# EAGLE design ControlPanel (EAGLE 9.6.2)
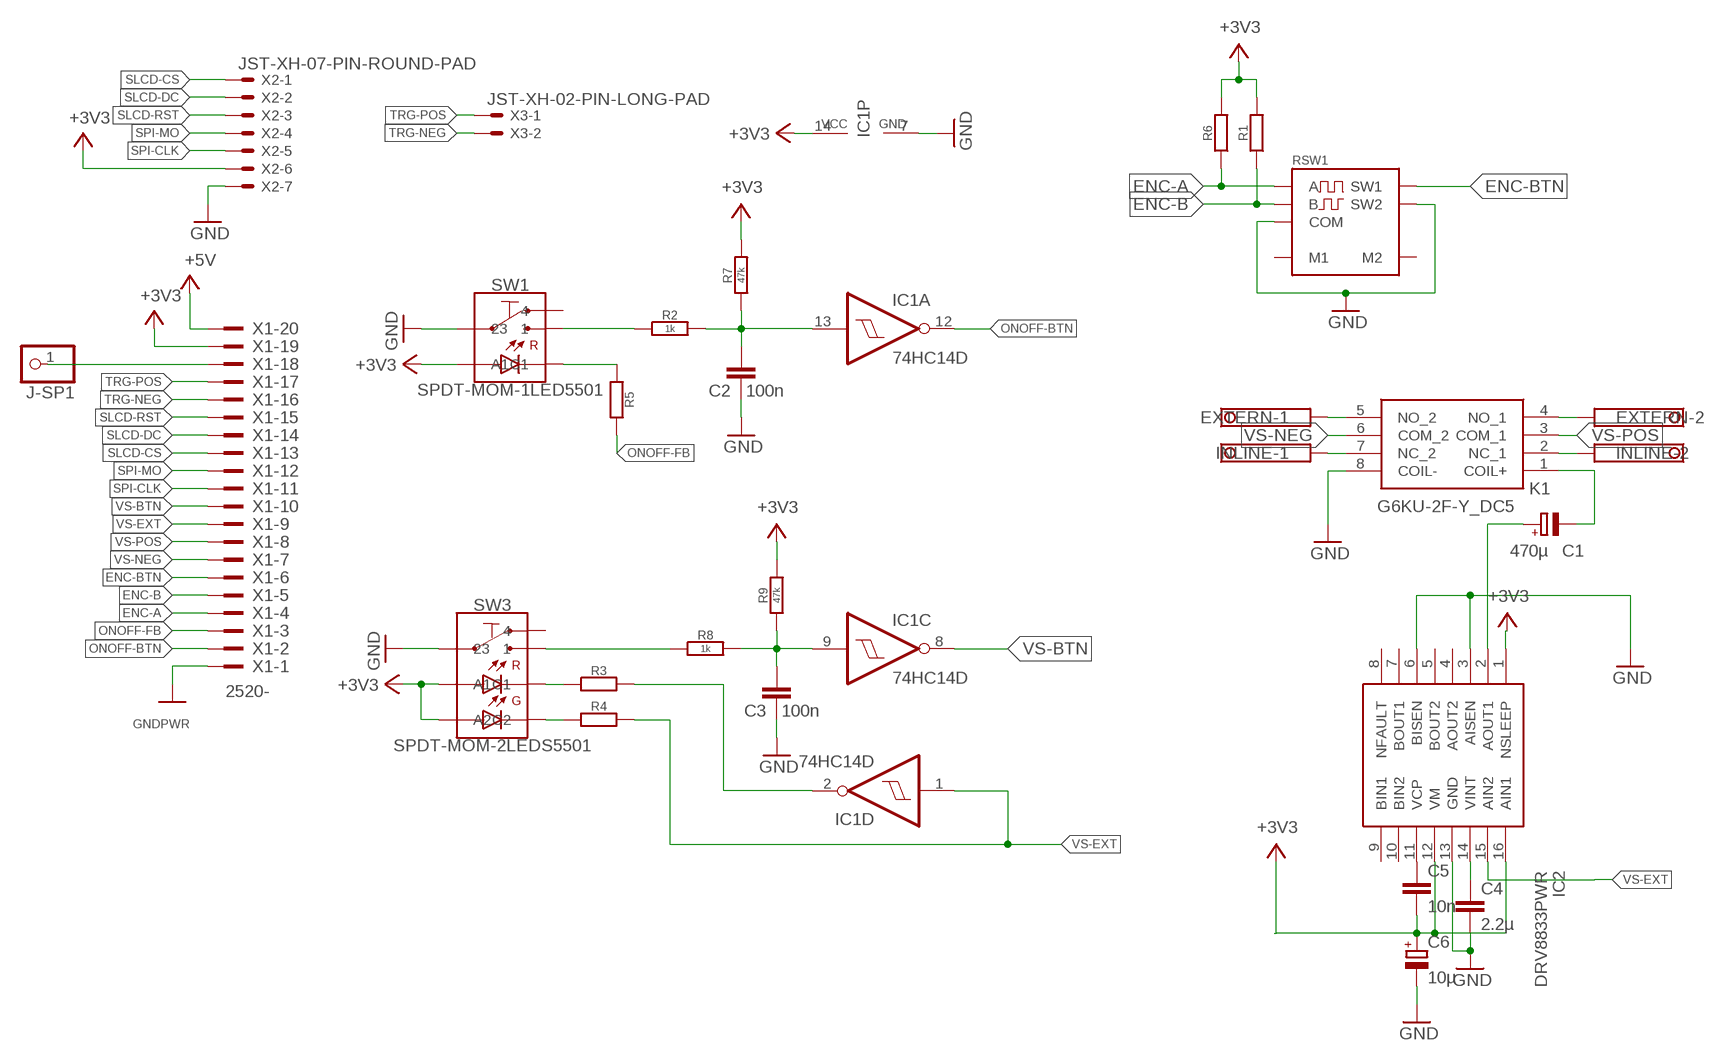
[diagram p0: schematic, sheet 1]

## Parts
C1  470µ  CPOL-EUE5-10.5  [E5-10,5]
C2  100n  CAPACITOR805  [0805]
C3  100n  CAPACITOR805  [0805]
C4  2.2µ  CAPACITOR805  [0805]
C5  10n  CAPACITOR805  [0805]
C6  10µ  CPOL-EUE2-5  [E2-5]
EXTERN  1751248  [1751248]
IC1  74HC14D  [SO14]
IC2  DRV8833PWR  [SOP65P640X120-16N]
INLINE  1751248  [1751248]
J-SP1  PINHD-1X1  [1X01]
K1  G6KU-2F-Y_DC5  [G6KU2FYDC5]
R1  RESISTOR1206  [1206]
R2  1k  RESISTOR805  [0805]
R3  RESISTOR1206  [1206]
R4  RESISTOR1206  [1206]
R5  RESISTOR1206  [1206]
R6  RESISTOR1206  [1206]
R7  47k  RESISTOR805  [0805]
R8  1k  RESISTOR805  [0805]
R9  47k  RESISTOR805  [0805]
RSW1  SW-EC11E  [EC11E]
SW1  SPDT-MOM-1LED5501  [5501-BTN-1LED]
SW3  SPDT-MOM-2LEDS5501  [5501-BTN-2LEDS]
X1  2520-  [PAK100/2500-20]
X2  JST-XH-07-PIN-ROUND-PAD  [JST-XH-07-PACKAGE-ROUND-PAD]
X3  JST-XH-02-PIN-LONG-PAD  [JST-XH-02-PACKAGE-LONG-PAD]

## Nets
+3V3: C5.2 C6.+ IC1.14(P:VCC) IC2.1(NSLEEP) IC2.12(VM) IC2.16(AIN1) R1.2 R6.2 R7.2 R9.2 SW1.5(A1) SW3.5(A1) SW3.8(A2) X1.19 X2.6
+5V: X1.20
ENC-A: R6.1 RSW1.A X1.4
ENC-B: R1.1 RSW1.B X1.5
ENC-BTN: RSW1.SW1 X1.6
GND: C2.1 C3.1 C4.2 C6.- IC1.7(P:GND) IC2.3(AISEN) IC2.6(BISEN) IC2.13(GND) K1.8(COIL-) RSW1.C(COM) RSW1.SW2 SW1.2 SW1.3 SW3.2 SW3.3 X1.1 X2.7 ; supply symbol labelled GNDPWR
N$1: R8.1 SW3.1
N$2: EXTERN.1 K1.5(NO_2)
N$3: R5.1 SW1.8(C1)
N$4: R2.1 SW1.1
N$6: R4.1 SW3.7(C2)
N$7: R3.1 SW3.6(C1)
N$8: INLINE.1 K1.7(NC_2)
N$9: C2.2 IC1.13(A:I) R2.2 R7.1
N$10: INLINE.2 K1.2(NC_1)
N$12: EXTERN.2 K1.4(NO_1)
N$13: C1.- K1.1(COIL+)
N$14: C1.+ IC2.2(AOUT1)
N$15: C4.1 IC2.14(VINT)
N$16: C3.2 IC1.9(C:I) R8.2 R9.1
N$17: C5.1 IC2.11(VCP)
N$23: J-SP1.1 X1.18
ONOFF-BTN: IC1.12(A:O) X1.2
ONOFF-FB: R5.2 X1.3
SLCD-CS: X1.13 X2.1
SLCD-DC: X1.14 X2.2
SLCD-RST: X1.15 X2.3
SPI-CLK: X1.11 X2.5
SPI-MO: X1.12 X2.4
TRG-NEG: X1.16 X3.2
TRG-POS: X1.17 X3.1
V-INL: IC1.2(D:O) R3.2
VS-BTN: IC1.8(C:O) X1.10
VS-EXT: IC1.1(D:I) IC2.15(AIN2) R4.2 X1.9
VS-NEG: K1.6(COM_2) X1.7
VS-POS: K1.3(COM_1) X1.8
Unconnected: IC1.3(E:I) IC1.4(E:O) IC1.5(F:I) IC1.6(F:O) IC1.10(B:O) IC1.11(B:I) IC2.4(AOUT2) IC2.5(BOUT2) IC2.7(BOUT1) IC2.8(NFAULT) IC2.9(BIN1) IC2.10(BIN2) RSW1.M11(M1) RSW1.M12(M1) RSW1.M21(M2) RSW1.M22(M2) SW1.4 SW3.4

## Library data of the parts
C1 C6 = resistor:CPOL-EU: POLARIZED CAPACITOR, European symbol
C2-C5 = VDS-Basics:CAPACITOR
EXTERN INLINE = con-phoenix-350:1751248: MKDS 1/ 2-3,5 Printklemme Nennstrom: 10 A Bemessungsspannung: 160 V Raster: 3,5 mm Polzahl: 2 Montageart: Löten Anschlussart: Schraubanschluss Anschlussrichtung vom Leiter zur Platine: 0° Source: http://eshop.phoenixcontact.com .. 1751248.pdf; OC_FARNELL: unknown; OC_NEWARK: unknown
IC1 = 74xx-eu:74*14: Hex schmitt trigger INVERTER
IC2 = SamacSys_Parts:DRV8833PWR: 2A Low Voltage Dual Brushed DC or Single Bipolar Stepper Motor Driver (PWM Ctrl) Source: Datasheet <http://www.ti.com/lit/gpn/drv8833>; ARROW_PART_NUMBER: DRV8833PWR; ARROW_PRICE-STOCK: https://www.arrow.com/en/products/drv8833pwr/texas-instruments; DESCRIPTION: 2A Low Voltage Dual Brushed DC or Single Bipolar Stepper Motor Driver (PWM Ctrl); HEIGHT: 1.2mm; MANUFACTURER_NAME: Texas Instruments; MANUFACTURER_PART_NUMBER: DRV8833PWR; MOUSER_PART_NUMBER: 595-DRV8833PWR; MOUSER_PRICE-STOCK: https://www.mouser.co.uk/ProductDetail/Texas-Instruments/DRV8833PWR?qs=biyDIajrTn6zZVfCUiXZ9g%3D%3D
J-SP1 = pinhead:PINHD-1X1: PIN HEADER
K1 = SamacSys_Parts:G6KU-2F-Y_DC5: Low Signal Relays - PCB Gullwing 1Coil 3.2mm DPDT 5VDC 100mW Source: Datasheet <https://componentsearchengine.com/Datasheets/1/G6KU-2F-Y DC5.pdf>; ARROW_PART_NUMBER: G6KU-2F-Y DC5; DESCRIPTION: Low Signal Relays - PCB Gullwing 1Coil 3.2mm DPDT 5VDC 100mW; HEIGHT: 5.4mm; MANUFACTURER_NAME: Omron Electronics; MANUFACTURER_PART_NUMBER: G6KU-2F-Y DC5; MOUSER_PART_NUMBER: 653-G6KU-2F-YDC5; MOUSER_PRICE-STOCK: https://www.mouser.co.uk/ProductDetail/Omron-Electronics/G6KU-2F-Y-DC5?qs=wkx8pu8tL7IUPbObPfSPKg%3D%3D
R1-R9 = VDS-Basics:RESISTOR
RSW1 = jt-alps-rotary:SW-EC11*
SW1 = VAS-Switches:SPDT-MOM-1LED
SW3 = VAS-Switches:SPDT-MOM-2LEDS
X1 = con-3m:2520-: 3M (TM) Pak 100 4-Wall Header Source: 3M; OC_FARNELL: unknown; OC_NEWARK: unknown
X2 = Rembrandt Electronics - JST XH Connectors v1-0:JST-XH-07-PIN: JST XH Connector 2 Pin Wire to board connector. Pitch: 2,54 mm, (0.100") Number of pins: 7 Created by Rembrandt Electronics www.rembrandtelectronics.com
X3 = Rembrandt Electronics - JST XH Connectors v1-0:JST-XH-02-PIN: JST XH Connector 2 Pin Wire to board connector. Pitch: 2,54 mm, (0.100") Number of pins: 2 Created by Rembrandt Electronics www.rembrandtelectronics.com

## Board
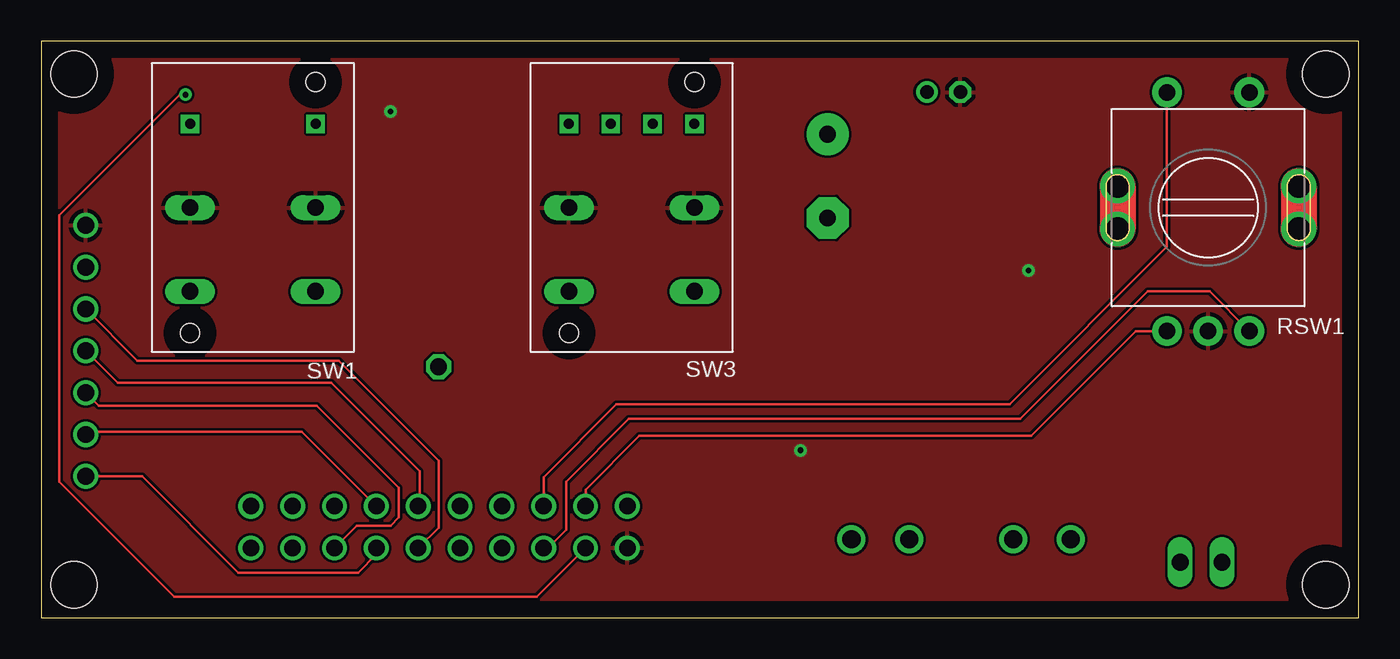
[diagram p1: board, top side]
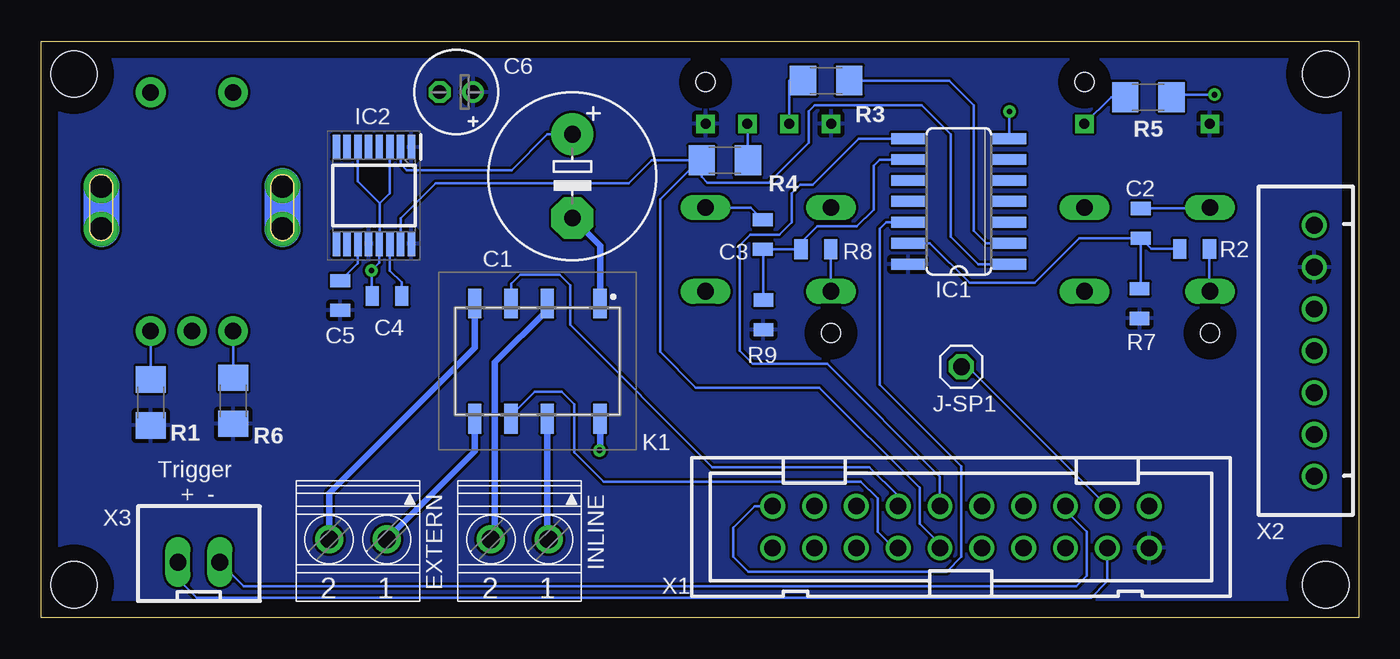
[diagram p2: board, bottom side, seen from below]

Size 80 x 35 mm. Coordinates in mm from the lower left corner, seen from the top.
Outline: 80,35 0,35 0,0 80,0 80,35
Copper layers (1*16): Top 0.035mm / dielectric 1.5mm / Bottom 0.035mm
Design rules "default": minimum track width 6mil, minimum drill 0.35mm, track to track 6mil, track to pad 6mil, pad to pad 6mil, via to via 6mil, smd to smd 6mil, copper to edge 40mil, drill to drill 6mil, minimum pad ring 10mil, minimum via ring 8mil, stop-mask expansion 4mil, vias tented up to drill 0mil, thermal gap 10mil
Holes 2.8 mm at 2,2 2,33 78,33 78,2

### Footprints (pad centres in the part's own frame; a part is rotated, then mirrored left to right if it is on the bottom)
E5-10,5 = drill 1.016 pad 2.54: + -2.54,0 | drill 1.016 pad 2.54 octagon: - 2.54,0
0805 = smd 0.8 x 1.2: 1 -0.9,0; 2 0.9,0
E2-5 = drill 0.813 pad 1.27: + -1.016,0 | drill 0.813 pad 1.27 octagon: - 1.016,0
1751248 = drill 1.1 pad 1.7: 1 -1.75,-0.1; 2 1.75,-0.1
SO14 = smd 0.66 x 2.032: 1 -3.81,-3.073; 2 -2.54,-3.073; 3 -1.27,-3.073; 4 0,-3.073; 5 1.27,-3.073; 6 2.54,-3.073; 7 3.81,-3.073; 8 3.81,3.073; 9 2.54,3.073; 10 1.27,3.073; 11 0,3.073; 12 -1.27,3.073; 13 -2.54,3.073; 14 -3.81,3.073
SOP65P640X120-16N = smd 1.475 x 0.45: 1 -2.938,2.275; 2 -2.938,1.625; 3 -2.938,0.975; 4 -2.938,0.325; 5 -2.938,-0.325; 6 -2.938,-0.975; 7 -2.938,-1.625; 8 -2.938,-2.275; 9 2.938,-2.275; 10 2.938,-1.625; 11 2.938,-0.975; 12 2.938,-0.325; 13 2.938,0.325; 14 2.938,0.975; 15 2.938,1.625; 16 2.938,2.275
1X01 = drill 1.016 octagon: 1 0,0
G6KU2FYDC5 = smd 0.8 x 1.8: 1 -3.8,-3.5; 2 -0.6,-3.5; 3 1.6,-3.5; 4 3.8,-3.5; 5 3.8,3.5; 6 1.6,3.5; 7 -0.6,3.5; 8 -3.8,3.5
1206 = smd 1.6 x 1.8: 1 -1.4,0; 2 1.4,0
EC11E = drill 1 pad 1.8: A -2.5,-7.5; B 2.5,-7.5; C 0,-7.5; SW1 -2.5,7; SW2 2.5,7 | drill 1.4: M11 -5.5,1.3; M12 -5.5,-1.3; M21 5.5,1.3; M22 5.5,-1.3
5501-BTN-1LED = drill 1.016 long: 1 5.08,-3.81; 2 0,-3.81; 3 0,3.81; 4 5.08,3.81 | drill 0.6 square: 5 -5.08,-3.81; 8 -5.08,3.81 | hole 1.143: -7.62,3.81; 7.62,-3.81
5501-BTN-2LEDS = drill 1.016 long: 1 5.08,-3.81; 2 0,-3.81; 3 0,3.81; 4 5.08,3.81 | drill 0.6 square: 5 -5.08,-3.81; 6 -5.08,-1.27; 7 -5.08,1.27; 8 -5.08,3.81 | hole 1.143: -7.62,3.81; 7.62,-3.81
PAK100/2500-20 = drill 1 pad 1.422: 1 -11.43,-1.27; 2 -11.43,1.27; 3 -8.89,-1.27; 4 -8.89,1.27; 5 -6.35,-1.27; 6 -6.35,1.27; 7 -3.81,-1.27; 8 -3.81,1.27; 9 -1.27,-1.27; 10 -1.27,1.27; 11 1.27,-1.27; 12 1.27,1.27; 13 3.81,-1.27; 14 3.81,1.27; 15 6.35,-1.27; 16 6.35,1.27; 17 8.89,-1.27; 18 8.89,1.27; 19 11.43,-1.27; 20 11.43,1.27
JST-XH-07-PACKAGE-ROUND-PAD = drill 1.016: 1 -7.62,0; 2 -5.08,0; 3 -2.54,0; 4 0,0; 5 2.54,0; 6 5.08,0; 7 7.62,0
JST-XH-02-PACKAGE-LONG-PAD = drill 1.016 long: 1 -1.27,0; 2 1.27,0

### Placement (x,y rotation side)
C1  47.75,26.81 270 bottom
C2  13.24,23.94 270 bottom
C3  36.2,23.26 270 bottom
C4  59.01,19.53 180 bottom
C5  61.85,19.56 270 bottom
C6  54.79,31.91 180 bottom
EXTERN  60.77,4.65 180 bottom
IC1  24.29,25.27 90 bottom
IC2  59.8,25.63 270 bottom
INLINE  50.95,4.65 180 bottom
J-SP1  24.13,15.24 0 bottom
K1  49.87,15.58 180 bottom
R1  73.35,13.07 270 bottom
R2  9.97,22.38 180 bottom
R3  32.34,32.61 0 bottom
R4  38.49,27.77 180 bottom
R5  12.78,31.59 0 bottom
R6  68.34,13.17 270 bottom
R7  13.32,19.06 270 bottom
R8  32.97,22.37 180 bottom
R9  36.15,18.39 270 bottom
RSW1  70.85,24.89 0 top
SW1  12.85,24.89 270 top
SW3  35.85,24.89 270 top
X1  24.16,5.5 0 bottom
X2  2.7,16.2 90 bottom
X3  70.42,3.37 0 bottom

### Tracks (layer width: path | path; a pad name or v marks a point on that pad's centre or on a via)
+3V3
  pour Bottom: -1.3,36.1 -1.3,-0.9 81.3,-0.9 81.3,36.2 -1.3,36.2
ENC-A
  Top 0.152: X1.4 33.05,7.78 36.32,11.05 60.1,11.05 66.45,17.39 RSW1.A
  Bottom 0.152: RSW1.A R6.1
ENC-B
  Top 0.152: RSW1.B 70.93,19.81 67.18,19.81 59.44,12.06 35.69,12.06 31.88,8.26 31.88,5.33 30.77,4.23 X1.5
  Bottom 0.152: RSW1.B R1.1
ENC-BTN
  Top 0.152: RSW1.SW1 68.35,22.5 58.8,12.95 34.92,12.95 30.51,8.54 X1.6
GND  (via drill 0.35)
  Bottom 0.152: SW1.2 9.09,24.84 C2.1 | 46.07,10.19 v46.1,10.16 | IC1.7 v21.21,30.73 | IC2.6 60.77,26.48 59.44,25.15 | 59.44,25.15 59.44,22.73 IC2.13 59.48,21.55 v59.94,21.08 59.94,19.56 C4.2 | IC2.3 58.83,25.76 59.44,25.15 | C3.1 36.93,24.89 SW3.3
  Bottom 0.406: K1.8 46.07,10.19
  pour Top: 80.5,-0.4 -0.9,-0.4 -0.9,35.65 80.5,35.65
N$1
  Bottom 0.152: R8.1 32.07,19.84 SW3.1
N$2
  Bottom 0.406: EXTERN.1 53.67,10.1 K1.5
N$3
  Bottom 0.152: SW1.8 15.04,31.59 R5.1
N$4
  Bottom 0.152: R2.1 9.07,19.84 SW1.1
N$6
  Bottom 0.152: SW3.7 37.09,29.98 R4.1
N$7
  Bottom 0.152: SW3.6 34.58,32.61 R3.1
N$8
  Bottom 0.406: INLINE.1 49.27,4.82 K1.7
N$9
  Bottom 0.152: R2.2 11.87,22.38 11.88,22.39 12.6,22.39 C2.2 | C2.2 13.24,20.04 R7.1 | C2.2 16.96,23.04 19.68,20.32 23.62,20.32 26.04,22.73 IC1.13
N$10
  Bottom 0.406: INLINE.2 52.45,5 52.45,15.49 49.27,18.68 K1.2
N$12
  Bottom 0.406: EXTERN.2 62.52,7.55 53.67,16.39 K1.4
N$13
  Bottom 0.406: C1.- 46.07,22.59 K1.1
N$14
  Bottom 0.152: C1.+ 49.26,29.35 51.44,27.18 57.8,27.18 58.17,27.55 IC2.2
N$15
  Bottom 0.152: IC2.14 58.83,21.07 58.11,20.35 C4.1
N$16
  Bottom 0.152: R9.1 36.15,22.32 C3.2 33.88,22.36 R8.2 33.87,22.77 32.89,23.75 30.48,23.75 29.46,24.77 29.46,27.43 29.08,27.81 IC1.9
N$17
  Bottom 0.152: C5.1 60.77,21.53 IC2.11
N$23
  Bottom 0.152: X1.18 23.74,15.24 J-SP1.1
ONOFF-BTN
  Bottom 0.152: X1.2 36.66,6.77 37.97,5.46 37.97,3.68 37.08,2.79 25.02,2.79 24.13,3.68 24.13,9.18 29.08,14.14 29.08,23.62 28.7,24 IC1.12
ONOFF-FB  (via drill 0.35)
  Top 0.152: X1.3 30.09,1.27 8.07,1.27 1.09,8.24 1.09,24.42 8.43,31.75 v8.76,31.75
  Bottom 0.152: v8.76,31.75 11.23,31.75 R5.2
SLCD-CS
  Top 0.152: X2.1 6.12,8.58 11.97,2.74 19.25,2.74 20.35,3.84 X1.13
SLCD-DC
  Top 0.152: X2.2 2.88,11.29 15.82,11.29 X1.14
SLCD-RST
  Top 0.152: X2.3 3.5,12.86 16.73,12.86 21.72,7.87 21.72,6.1 21.21,5.59 19.17,5.59 X1.15
SPI-CLK
  Top 0.152: X2.5 5.85,15.59 18.06,15.59 24.13,9.53 24.13,5.47 X1.11
SPI-MO
  Top 0.152: X2.4 4.64,14.26 17.62,14.26 22.99,8.89 22.99,6.87 X1.12
TRG-NEG
  Bottom 0.152: X1.16 17.81,6.51 16.51,5.21 16.51,2.54 17.14,1.91 41.91,1.91 42.42,1.91 67.69,1.91 X3.2
TRG-POS
  Bottom 0.152: X1.17 15.27,2.21 16.26,1.22 70.56,1.22 71.69,2.35 X3.1
V-INL
  Bottom 0.152: R3.2 24.86,32.61 23.37,31.11 23.37,23.5 22.61,22.73 IC1.2
VS-BTN
  Bottom 0.152: IC1.8 30.35,29.08 33.15,26.29 33.91,26.29 34.42,25.78 34.42,24 35.18,23.24 36.96,23.24 37.59,22.61 37.59,16.21 36.79,15.41 32.29,15.41 25.43,8.55 X1.10
VS-EXT
  Bottom 0.152: R4.2 39.9,26.75 39.56,26.42 35.81,26.42 33.4,28.83 33.4,30.73 33.02,31.11 26.54,31.11 24.77,29.34 24.77,23.11 23.11,21.46 IC1.1 | R4.2 42.94,27.77 44.34,26.37 56.05,26.37 58.17,24.25 IC2.15 | X1.9 25.43,4.47 26.67,5.71 26.67,7.87 32.77,13.97 40.26,13.97 42.42,16.13 42.42,25.4 40.05,27.77 R4.2
VS-NEG
  Bottom 0.152: K1.6 51.47,12.28 50.04,13.72 48.39,13.72 47.62,12.95 47.62,10.03 45.85,8.26 30.23,8.26 29.21,7.24 29.21,5.21 28.23,4.23 X1.7
VS-POS
  Bottom 0.152: K1.3 51.47,20.29 50.93,20.83 48.51,20.83 47.88,20.19 47.88,17.78 39.24,9.14 29.72,9.14 27.97,7.4 X1.8

### Text on the board
bNames: Trigger / + -